# Altium schematic sheet eMMC_Module.SchDoc
size A4; SheetNumber: 10; SheetTotal: 13
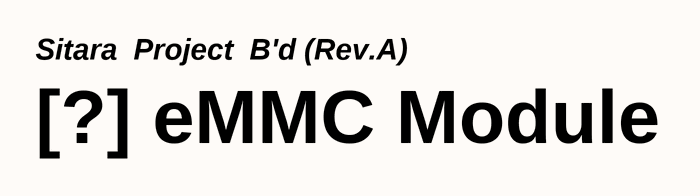
[diagram p0: eMMC_Module.SchDoc]

## Notes on the sheet
- Sitara  Project  B'd (Rev.A)
- [?] eMMC Module
- Title
- Rev
- Doc
- Sheet #
- of
- Engineer
- This document is copyright of ArkX and shall not be revealed, produced, copied, in whole or in part,
- Date
- nor used for any purpose other than submitted.